# EAGLE board proto4-1pp (EAGLE 6.6.0)
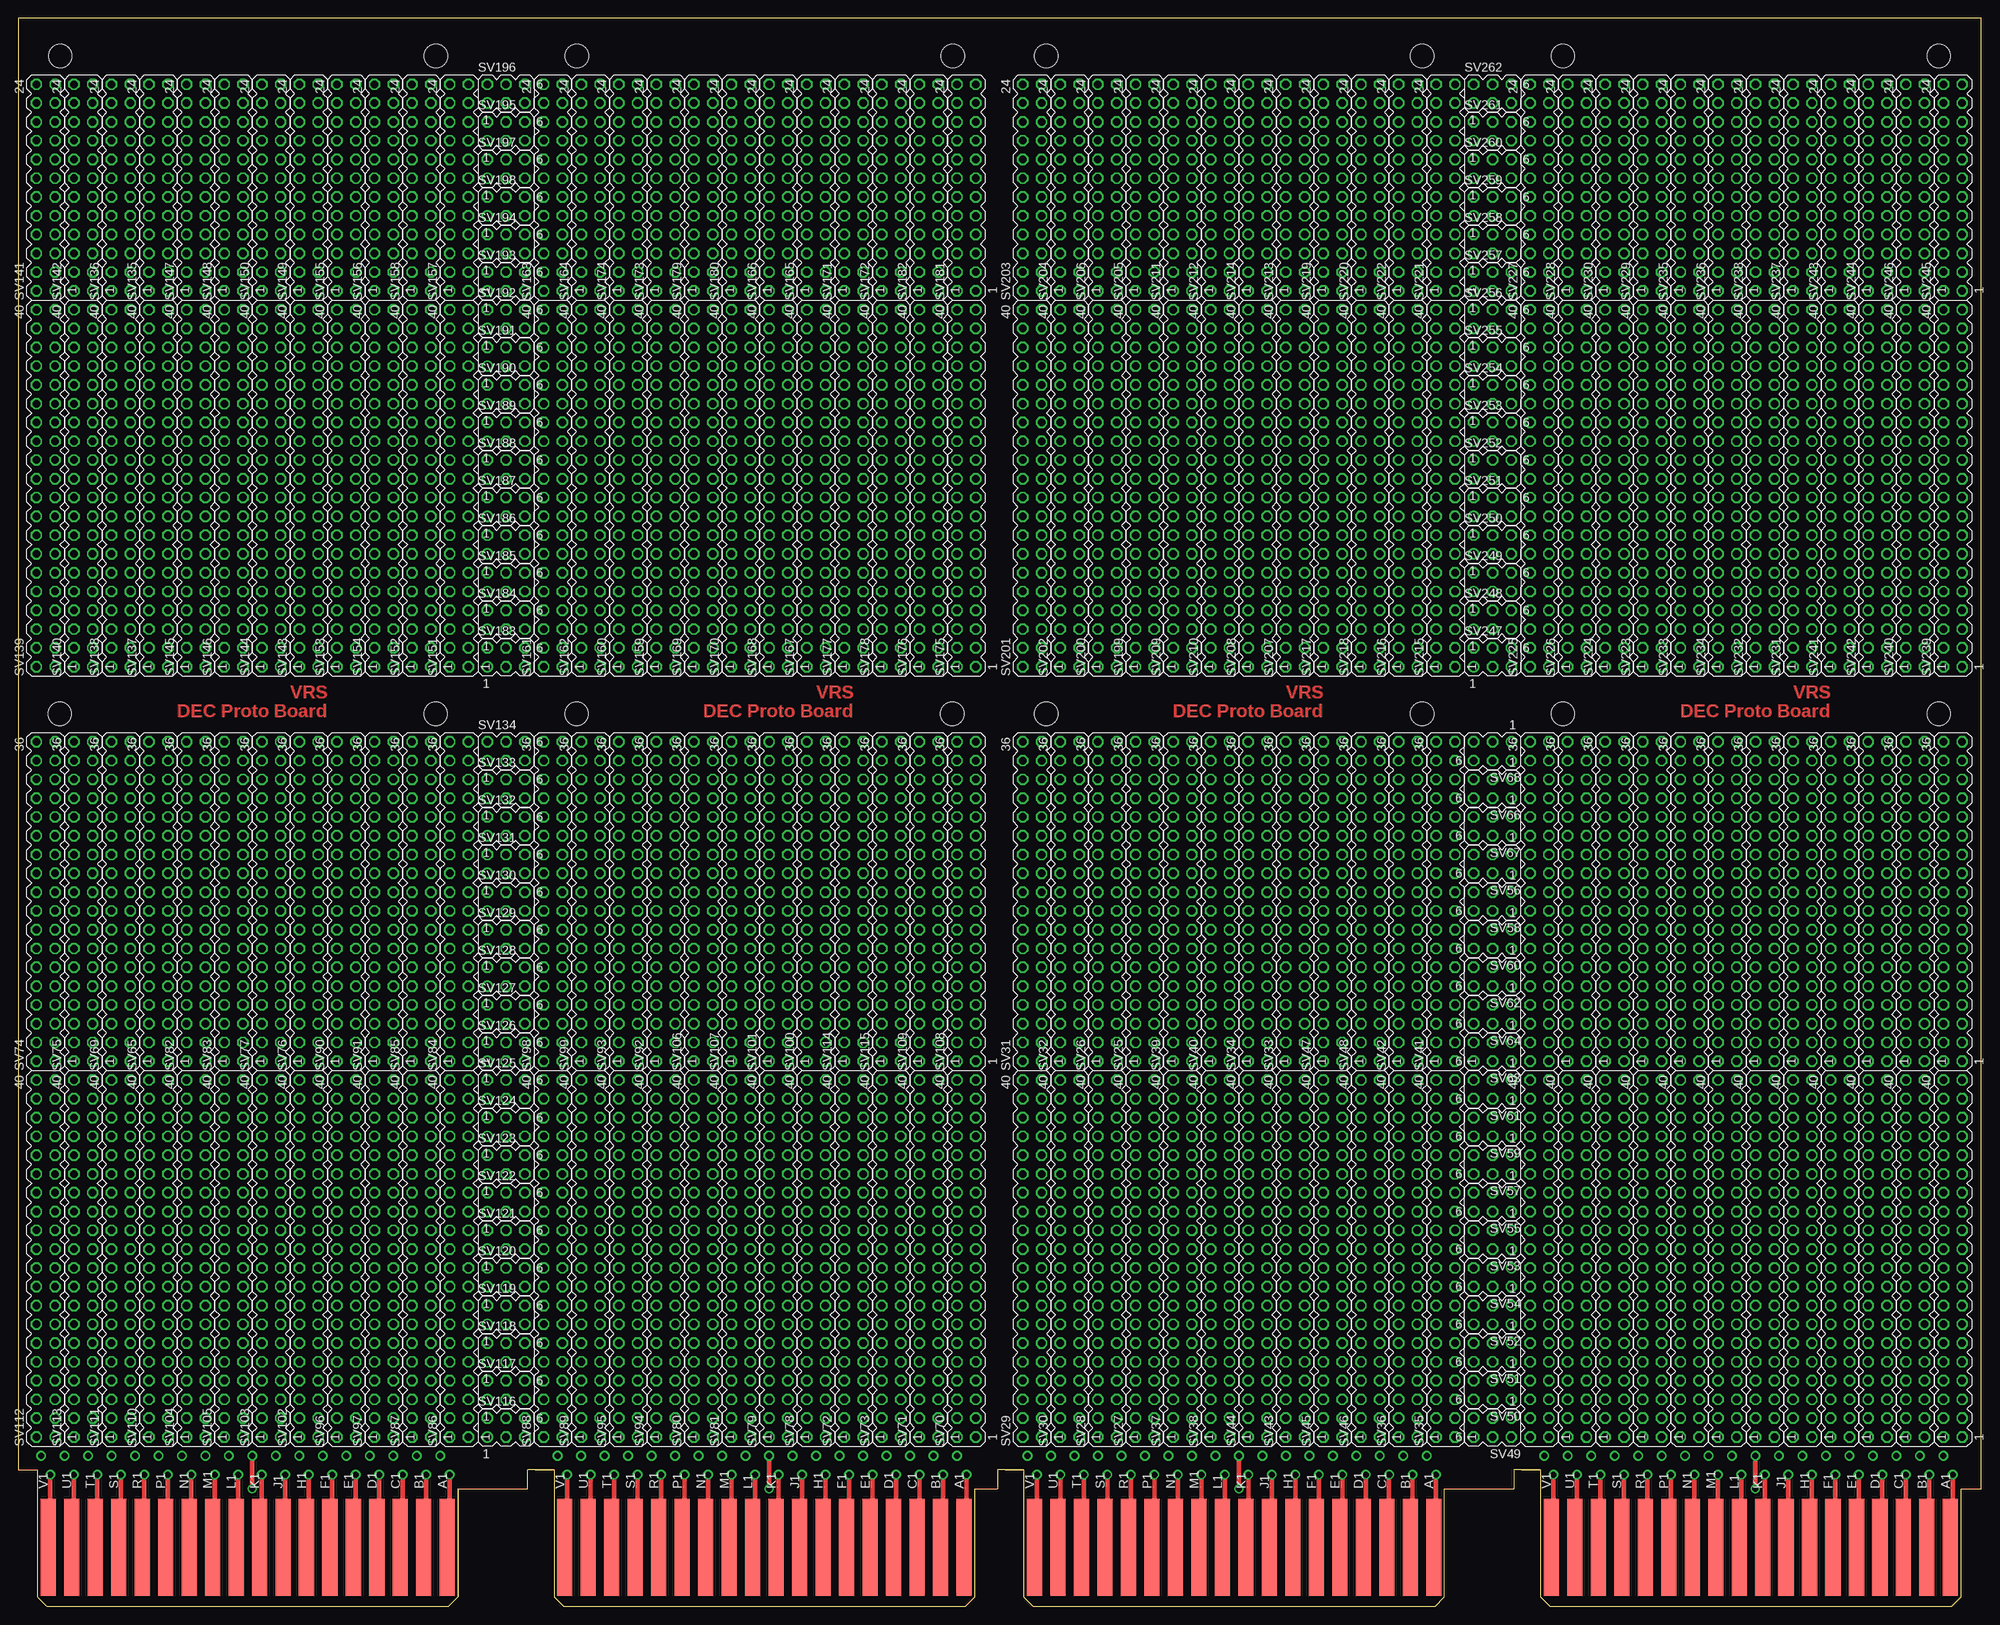
[diagram p5: board, top side]
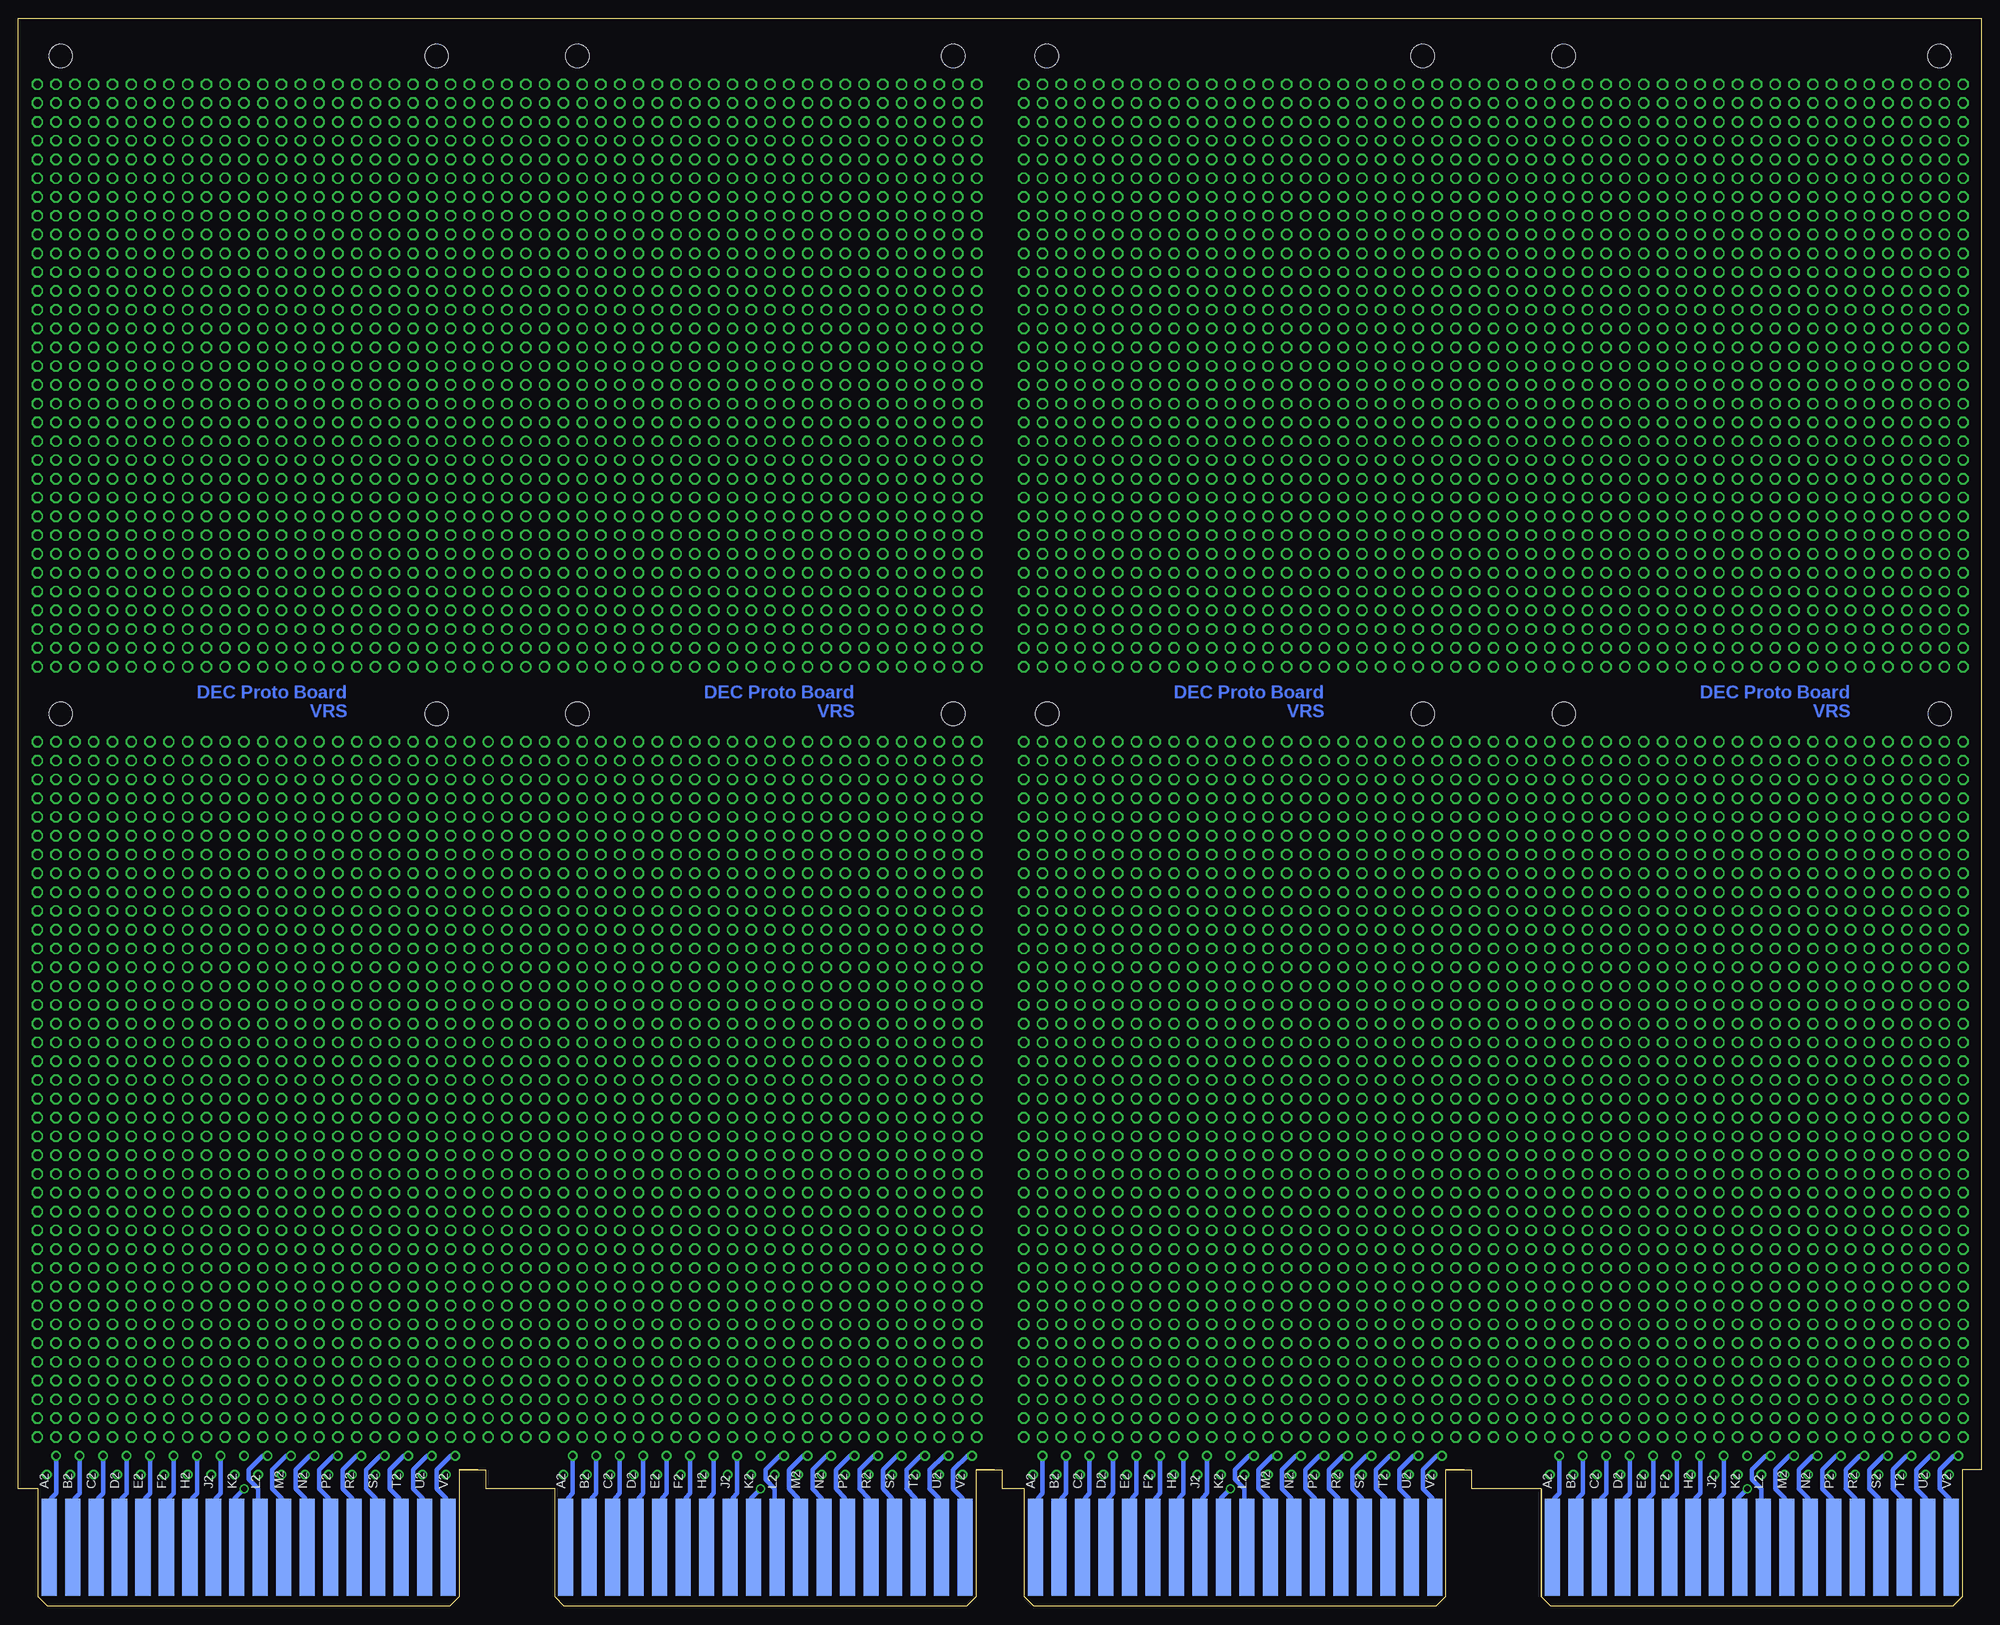
[diagram p6: board, bottom side, seen from below]

Size 265.3 x 214.63 mm. Coordinates in mm from the lower left corner, seen from the top.
Copper layers (1+16): Top 0.035mm / dielectric 1.5mm / Bottom 0.035mm
Design rules "16mils": minimum track width 16mil, minimum drill 32mil, track to track 15mil, track to pad 10mil, pad to pad 10mil, via to via 10mil, smd to smd 10mil, copper to edge 13mil, drill to drill 10mil, minimum pad ring 10mil, minimum via ring 8mil, stop-mask expansion 0mil, vias tented up to drill 0mil, thermal gap 10mil
Net classes: 0 default: width 0.635 mm
Holes 3.17 mm at 5.59,120.65 75.44,120.65 56.39,120.65 126.24,120.65 138.94,120.65 208.79,120.65 189.74,120.65 259.59,120.65

## Footprints (pad centres in the part's own frame; a part is rotated, then mirrored left to right if it is on the bottom)
EDGE-CON2 = smd 13.106 x 2.032: A1 7.938,4.128; B1 7.938,7.303; C1 7.938,10.477; D1 7.938,13.652; E1 7.938,16.828; F1 7.938,20.003; H1 7.938,23.177; J1 7.938,26.352; K1 7.938,29.527; L1 7.938,32.703; M1 7.938,35.877; N1 7.938,39.053; P1 7.938,42.227; R1 7.938,45.403; S1 7.938,48.578; T1 7.938,51.752; U1 7.938,54.928; V1 7.938,58.102 | smd 13.106 x 2.032 bottom: A2 7.938,4.128; B2 7.938,7.303; C2 7.938,10.477; D2 7.938,13.652; E2 7.938,16.828; F2 7.938,20.003; H2 7.938,23.177; J2 7.938,26.352; K2 7.938,29.527; L2 7.938,32.703; M2 7.938,35.877; N2 7.938,39.053; P2 7.938,42.227; R2 7.938,45.403; S2 7.938,48.578; T2 7.938,51.752; U2 7.938,54.928; V2 7.938,58.102
MA20-2 = drill 1.016 octagon: 1 -24.13,-1.27; 2 -24.13,1.27; 3 -21.59,-1.27; 4 -21.59,1.27; 5 -19.05,-1.27; 6 -19.05,1.27; 7 -16.51,-1.27; 8 -16.51,1.27; 9 -13.97,-1.27; 10 -13.97,1.27; 11 -11.43,-1.27; 12 -11.43,1.27; 13 -8.89,-1.27; 14 -8.89,1.27; 15 -6.35,-1.27; 16 -6.35,1.27; 17 -3.81,-1.27; 18 -3.81,1.27; 19 -1.27,-1.27; 20 -1.27,1.27; 21 1.27,-1.27; 22 1.27,1.27; 23 3.81,-1.27; 24 3.81,1.27; 25 6.35,-1.27; 26 6.35,1.27; 27 8.89,-1.27; 28 8.89,1.27; 29 11.43,-1.27; 30 11.43,1.27; 31 13.97,-1.27; 32 13.97,1.27; 33 16.51,-1.27; 34 16.51,1.27; 35 19.05,-1.27; 36 19.05,1.27; 37 21.59,-1.27; 38 21.59,1.27; 39 24.13,-1.27; 40 24.13,1.27
MA18-2 = drill 1.016 octagon: 1 -21.59,-1.27; 2 -21.59,1.27; 3 -19.05,-1.27; 4 -19.05,1.27; 5 -16.51,-1.27; 6 -16.51,1.27; 7 -13.97,-1.27; 8 -13.97,1.27; 9 -11.43,-1.27; 10 -11.43,1.27; 11 -8.89,-1.27; 12 -8.89,1.27; 13 -6.35,-1.27; 14 -6.35,1.27; 15 -3.81,-1.27; 16 -3.81,1.27; 17 -1.27,-1.27; 18 -1.27,1.27; 19 1.27,-1.27; 20 1.27,1.27; 21 3.81,-1.27; 22 3.81,1.27; 23 6.35,-1.27; 24 6.35,1.27; 25 8.89,-1.27; 26 8.89,1.27; 27 11.43,-1.27; 28 11.43,1.27; 29 13.97,-1.27; 30 13.97,1.27; 31 16.51,-1.27; 32 16.51,1.27; 33 19.05,-1.27; 34 19.05,1.27; 35 21.59,-1.27; 36 21.59,1.27
MA03-2 = drill 1.016: 1 -2.54,-1.27 | drill 1.016 octagon: 2 -2.54,1.27; 3 0,-1.27; 4 0,1.27; 5 2.54,-1.27; 6 2.54,1.27
MA12-2 = drill 1.016 octagon: 1 -13.97,-1.27; 2 -13.97,1.27; 3 -11.43,-1.27; 4 -11.43,1.27; 5 -8.89,-1.27; 6 -8.89,1.27; 7 -6.35,-1.27; 8 -6.35,1.27; 9 -3.81,-1.27; 10 -3.81,1.27; 11 -1.27,-1.27; 12 -1.27,1.27; 13 1.27,-1.27; 14 1.27,1.27; 15 3.81,-1.27; 16 3.81,1.27; 17 6.35,-1.27; 18 6.35,1.27; 19 8.89,-1.27; 20 8.89,1.27; 21 11.43,-1.27; 22 11.43,1.27; 23 13.97,-1.27; 24 13.97,1.27
THRU-HOLEA = drill 0.813 pad 1.27: A1 17.78,3.81; A2 20.32,5.08; B1 17.78,6.985; B2 20.32,8.255; C1 17.78,10.16; C2 20.32,11.43; D1 17.78,13.335; D2 20.32,14.605; E1 17.78,16.51; E2 20.32,17.78; F1 17.78,19.685; F2 20.32,20.955; H1 17.78,22.86; H2 20.32,24.13; J1 17.78,26.035; J2 20.32,27.305; K1 17.78,29.21; K2 20.32,30.48; L1 17.78,32.385; L2 20.32,33.655; M1 17.78,35.56; M2 20.32,36.83; N1 17.78,38.735; N2 20.32,40.005; P1 17.78,41.91; P2 20.32,43.18; R1 17.78,45.085; R2 20.32,46.355; S1 17.78,48.26; S2 20.32,49.53; T1 17.78,51.435; T2 20.32,52.705; U1 17.78,54.61; U2 20.32,55.88; V1 17.78,57.785; V2 20.32,59.055
OMNIBUS = hole 3.175: 208.915,209.55; 259.715,209.55; 189.865,209.55; 139.065,209.55; 75.616,209.55; 126.416,209.55; 56.566,209.55; 5.766,209.55

## Placement (x,y rotation side)
A  [EDGE-CON2]  265.3,0 90 top
A1  [EDGE-CON2]  131.95,0 90 top
B  [EDGE-CON2]  195.45,0 90 top
B1  [EDGE-CON2]  62.1,0 90 top
SV1  [MA20-2]  261.49,46.99 90 top
SV2  [MA20-2]  256.41,46.99 90 top
SV3  [MA20-2]  246.25,46.99 90 top
SV4  [MA20-2]  251.33,46.99 90 top
SV5  [MA18-2]  246.25,95.25 90 top
SV6  [MA18-2]  251.33,95.25 90 top
SV7  [MA18-2]  261.49,95.25 90 top
SV8  [MA18-2]  256.41,95.25 90 top
SV9  [MA18-2]  241.17,95.25 90 top
SV10  [MA18-2]  236.09,95.25 90 top
SV11  [MA20-2]  241.17,46.99 90 top
SV12  [MA20-2]  236.09,46.99 90 top
SV13  [MA20-2]  225.93,46.99 90 top
SV14  [MA20-2]  231.01,46.99 90 top
SV15  [MA18-2]  225.93,95.25 90 top
SV16  [MA18-2]  231.01,95.25 90 top
SV17  [MA18-2]  220.85,95.25 90 top
SV18  [MA18-2]  215.77,95.25 90 top
SV19  [MA20-2]  220.85,46.99 90 top
SV20  [MA20-2]  215.77,46.99 90 top
SV21  [MA20-2]  205.61,46.99 90 top
SV22  [MA20-2]  210.69,46.99 90 top
SV23  [MA18-2]  205.61,95.25 90 top
SV24  [MA18-2]  210.69,95.25 90 top
SV25  [MA18-2]  152.27,95.25 90 top
SV26  [MA18-2]  147.19,95.25 90 top
SV27  [MA20-2]  152.27,46.99 90 top
SV28  [MA20-2]  147.19,46.99 90 top
SV29  [MA20-2]  137.03,46.99 90 top
SV30  [MA20-2]  142.11,46.99 90 top
SV31  [MA18-2]  137.03,95.25 90 top
SV32  [MA18-2]  142.11,95.25 90 top
SV33  [MA18-2]  172.59,95.25 90 top
SV34  [MA18-2]  167.51,95.25 90 top
SV35  [MA20-2]  192.91,46.99 90 top
SV36  [MA20-2]  187.83,46.99 90 top
SV37  [MA20-2]  157.35,46.99 90 top
SV38  [MA20-2]  162.43,46.99 90 top
SV39  [MA18-2]  157.35,95.25 90 top
SV40  [MA18-2]  162.43,95.25 90 top
SV41  [MA18-2]  192.91,95.25 90 top
SV42  [MA18-2]  187.83,95.25 90 top
SV43  [MA20-2]  172.59,46.99 90 top
SV44  [MA20-2]  167.51,46.99 90 top
SV45  [MA20-2]  177.67,46.99 90 top
SV46  [MA20-2]  182.75,46.99 90 top
SV47  [MA18-2]  177.67,95.25 90 top
SV48  [MA18-2]  182.75,95.25 90 top
SV49  [MA03-2]  199.26,24.13 180 top
SV50  [MA03-2]  199.26,29.21 180 top
SV51  [MA03-2]  199.26,34.29 180 top
SV52  [MA03-2]  199.26,39.37 180 top
SV53  [MA03-2]  199.26,49.53 180 top
SV54  [MA03-2]  199.26,44.45 180 top
SV55  [MA03-2]  199.26,54.61 180 top
SV56  [MA03-2]  199.26,100.33 180 top
SV57  [MA03-2]  199.26,59.69 180 top
SV58  [MA03-2]  199.26,95.25 180 top
SV59  [MA03-2]  199.26,64.77 180 top
SV60  [MA03-2]  199.26,90.17 180 top
SV61  [MA03-2]  199.26,69.85 180 top
SV62  [MA03-2]  199.26,85.09 180 top
SV63  [MA03-2]  199.26,74.93 180 top
SV64  [MA03-2]  199.26,80.01 180 top
SV65  [MA18-2]  18.92,95.25 90 top
SV66  [MA03-2]  199.26,110.49 180 top
SV67  [MA03-2]  199.26,105.41 180 top
SV68  [MA03-2]  199.26,115.57 180 top
SV69  [MA18-2]  13.84,95.25 90 top
SV70  [MA20-2]  128.14,46.99 90 top
SV71  [MA20-2]  123.06,46.99 90 top
SV72  [MA20-2]  112.9,46.99 90 top
SV73  [MA20-2]  117.98,46.99 90 top
SV74  [MA18-2]  3.68,95.25 90 top
SV75  [MA18-2]  8.76,95.25 90 top
SV76  [MA18-2]  39.24,95.25 90 top
SV77  [MA18-2]  34.16,95.25 90 top
SV78  [MA20-2]  107.82,46.99 90 top
SV79  [MA20-2]  102.74,46.99 90 top
SV80  [MA20-2]  92.58,46.99 90 top
SV81  [MA20-2]  97.66,46.99 90 top
SV82  [MA18-2]  24,95.25 90 top
SV83  [MA18-2]  29.08,95.25 90 top
SV84  [MA18-2]  59.56,95.25 90 top
SV85  [MA18-2]  54.48,95.25 90 top
SV86  [MA20-2]  59.56,46.99 90 top
SV87  [MA20-2]  54.48,46.99 90 top
SV88  [MA20-2]  72.26,46.99 90 top
SV89  [MA20-2]  77.34,46.99 90 top
SV90  [MA18-2]  44.32,95.25 90 top
SV91  [MA18-2]  49.4,95.25 90 top
SV92  [MA18-2]  87.5,95.25 90 top
SV93  [MA18-2]  82.42,95.25 90 top
SV94  [MA20-2]  87.5,46.99 90 top
SV95  [MA20-2]  82.42,46.99 90 top
SV96  [MA20-2]  44.32,46.99 90 top
SV97  [MA20-2]  49.4,46.99 90 top
SV98  [MA18-2]  72.26,95.25 90 top
SV99  [MA18-2]  77.34,95.25 90 top
SV100  [MA18-2]  107.82,95.25 90 top
SV101  [MA18-2]  102.74,95.25 90 top
SV102  [MA20-2]  39.24,46.99 90 top
SV103  [MA20-2]  34.16,46.99 90 top
SV104  [MA20-2]  24,46.99 90 top
SV105  [MA20-2]  29.08,46.99 90 top
SV106  [MA18-2]  92.58,95.25 90 top
SV107  [MA18-2]  97.66,95.25 90 top
SV108  [MA18-2]  128.14,95.25 90 top
SV109  [MA18-2]  123.06,95.25 90 top
SV110  [MA20-2]  18.92,46.99 90 top
SV111  [MA20-2]  13.84,46.99 90 top
SV112  [MA20-2]  3.68,46.99 90 top
SV113  [MA20-2]  8.76,46.99 90 top
SV114  [MA18-2]  112.9,95.25 90 top
SV115  [MA18-2]  117.98,95.25 90 top
SV116  [MA03-2]  65.91,24.13 0 top
SV117  [MA03-2]  65.91,29.21 0 top
SV118  [MA03-2]  65.91,34.29 0 top
SV119  [MA03-2]  65.91,39.37 0 top
SV120  [MA03-2]  65.91,44.45 0 top
SV121  [MA03-2]  65.91,49.53 0 top
SV122  [MA03-2]  65.91,54.61 0 top
SV123  [MA03-2]  65.91,59.69 0 top
SV124  [MA03-2]  65.91,64.77 0 top
SV125  [MA03-2]  65.91,69.85 0 top
SV126  [MA03-2]  65.91,74.93 0 top
SV127  [MA03-2]  65.91,80.01 0 top
SV128  [MA03-2]  65.91,85.09 0 top
SV129  [MA03-2]  65.91,90.17 0 top
SV130  [MA03-2]  65.91,95.25 0 top
SV131  [MA03-2]  65.91,100.33 0 top
SV132  [MA03-2]  65.91,105.41 0 top
SV133  [MA03-2]  65.91,110.49 0 top
SV134  [MA03-2]  65.91,115.57 0 top
SV135  [MA12-2]  18.92,191.77 90 top
SV136  [MA12-2]  13.84,191.77 90 top
SV137  [MA20-2]  18.92,151.13 90 top
SV138  [MA20-2]  13.84,151.13 90 top
SV139  [MA20-2]  3.68,151.13 90 top
SV140  [MA20-2]  8.76,151.13 90 top
SV141  [MA12-2]  3.68,191.77 90 top
SV142  [MA12-2]  8.76,191.77 90 top
SV143  [MA20-2]  39.24,151.13 90 top
SV144  [MA20-2]  34.16,151.13 90 top
SV145  [MA20-2]  24,151.13 90 top
SV146  [MA20-2]  29.08,151.13 90 top
SV147  [MA12-2]  24,191.77 90 top
SV148  [MA12-2]  29.08,191.77 90 top
SV149  [MA12-2]  39.24,191.77 90 top
SV150  [MA12-2]  34.16,191.77 90 top
SV151  [MA20-2]  59.56,151.13 90 top
SV152  [MA20-2]  54.48,151.13 90 top
SV153  [MA20-2]  44.32,151.13 90 top
SV154  [MA20-2]  49.4,151.13 90 top
SV155  [MA12-2]  44.32,191.77 90 top
SV156  [MA12-2]  49.4,191.77 90 top
SV157  [MA12-2]  59.56,191.77 90 top
SV158  [MA12-2]  54.48,191.77 90 top
SV159  [MA20-2]  87.5,151.13 90 top
SV160  [MA20-2]  82.42,151.13 90 top
SV161  [MA20-2]  72.26,151.13 90 top
SV162  [MA20-2]  77.34,151.13 90 top
SV163  [MA12-2]  72.26,191.77 90 top
SV164  [MA12-2]  77.34,191.77 90 top
SV165  [MA12-2]  107.82,191.77 90 top
SV166  [MA12-2]  102.74,191.77 90 top
SV167  [MA20-2]  107.82,151.13 90 top
SV168  [MA20-2]  102.74,151.13 90 top
SV169  [MA20-2]  92.58,151.13 90 top
SV170  [MA20-2]  97.66,151.13 90 top
SV171  [MA12-2]  112.9,191.77 90 top
SV172  [MA12-2]  117.98,191.77 90 top
SV173  [MA12-2]  87.5,191.77 90 top
SV174  [MA12-2]  82.42,191.77 90 top
SV175  [MA20-2]  128.14,151.13 90 top
SV176  [MA20-2]  123.06,151.13 90 top
SV177  [MA20-2]  112.9,151.13 90 top
SV178  [MA20-2]  117.98,151.13 90 top
SV179  [MA12-2]  92.58,191.77 90 top
SV180  [MA12-2]  97.66,191.77 90 top
SV181  [MA12-2]  128.14,191.77 90 top
SV182  [MA12-2]  123.06,191.77 90 top
SV183  [MA03-2]  65.91,128.27 0 top
SV184  [MA03-2]  65.91,133.35 0 top
SV185  [MA03-2]  65.91,138.43 0 top
SV186  [MA03-2]  65.91,143.51 0 top
SV187  [MA03-2]  65.91,148.59 0 top
SV188  [MA03-2]  65.91,153.67 0 top
SV189  [MA03-2]  65.91,158.75 0 top
SV190  [MA03-2]  65.91,163.83 0 top
SV191  [MA03-2]  65.91,168.91 0 top
SV192  [MA03-2]  65.91,173.99 0 top
SV193  [MA03-2]  65.91,179.07 0 top
SV194  [MA03-2]  65.91,184.15 0 top
SV195  [MA03-2]  65.91,199.39 0 top
SV196  [MA03-2]  65.91,204.47 0 top
SV197  [MA03-2]  65.91,194.31 0 top
SV198  [MA03-2]  65.91,189.23 0 top
SV199  [MA20-2]  152.27,151.13 90 top
SV200  [MA20-2]  147.19,151.13 90 top
SV201  [MA20-2]  137.03,151.13 90 top
SV202  [MA20-2]  142.11,151.13 90 top
SV203  [MA12-2]  137.03,191.77 90 top
SV204  [MA12-2]  142.11,191.77 90 top
SV205  [MA12-2]  152.27,191.77 90 top
SV206  [MA12-2]  147.19,191.77 90 top
SV207  [MA20-2]  172.59,151.13 90 top
SV208  [MA20-2]  167.51,151.13 90 top
SV209  [MA20-2]  157.35,151.13 90 top
SV210  [MA20-2]  162.43,151.13 90 top
SV211  [MA12-2]  157.35,191.77 90 top
SV212  [MA12-2]  162.43,191.77 90 top
SV213  [MA12-2]  172.59,191.77 90 top
SV214  [MA12-2]  167.51,191.77 90 top
SV215  [MA20-2]  192.91,151.13 90 top
SV216  [MA20-2]  187.83,151.13 90 top
SV217  [MA20-2]  177.67,151.13 90 top
SV218  [MA20-2]  182.75,151.13 90 top
SV219  [MA12-2]  177.67,191.77 90 top
SV220  [MA12-2]  182.75,191.77 90 top
SV221  [MA12-2]  192.91,191.77 90 top
SV222  [MA12-2]  187.83,191.77 90 top
SV223  [MA20-2]  220.85,151.13 90 top
SV224  [MA20-2]  215.77,151.13 90 top
SV225  [MA20-2]  205.61,151.13 90 top
SV226  [MA20-2]  210.69,151.13 90 top
SV227  [MA12-2]  205.61,191.77 90 top
SV228  [MA12-2]  210.69,191.77 90 top
SV229  [MA12-2]  220.85,191.77 90 top
SV230  [MA12-2]  215.77,191.77 90 top
SV231  [MA20-2]  241.17,151.13 90 top
SV232  [MA20-2]  236.09,151.13 90 top
SV233  [MA20-2]  225.93,151.13 90 top
SV234  [MA20-2]  231.01,151.13 90 top
SV235  [MA12-2]  225.93,191.77 90 top
SV236  [MA12-2]  231.01,191.77 90 top
SV237  [MA12-2]  241.17,191.77 90 top
SV238  [MA12-2]  236.09,191.77 90 top
SV239  [MA20-2]  261.49,151.13 90 top
SV240  [MA20-2]  256.41,151.13 90 top
SV241  [MA20-2]  246.25,151.13 90 top
SV242  [MA20-2]  251.33,151.13 90 top
SV243  [MA12-2]  246.25,191.77 90 top
SV244  [MA12-2]  251.33,191.77 90 top
SV245  [MA12-2]  261.49,191.77 90 top
SV246  [MA12-2]  256.41,191.77 90 top
SV247  [MA03-2]  199.26,128.27 0 top
SV248  [MA03-2]  199.26,133.35 0 top
SV249  [MA03-2]  199.26,138.43 0 top
SV250  [MA03-2]  199.26,143.51 0 top
SV251  [MA03-2]  199.26,148.59 0 top
SV252  [MA03-2]  199.26,153.67 0 top
SV253  [MA03-2]  199.26,158.75 0 top
SV254  [MA03-2]  199.26,163.83 0 top
SV255  [MA03-2]  199.26,168.91 0 top
SV256  [MA03-2]  199.26,173.99 0 top
SV257  [MA03-2]  199.26,179.07 0 top
SV258  [MA03-2]  199.26,184.15 0 top
SV259  [MA03-2]  199.26,189.23 0 top
SV260  [MA03-2]  199.26,194.31 0 top
SV261  [MA03-2]  199.26,199.39 0 top
SV262  [MA03-2]  199.26,204.47 0 top
U$1  THRU-HOLE2A  [THRU-HOLEA]  131.95,0 90 top
U$3  THRU-HOLE2A  [THRU-HOLEA]  265.3,0 90 top
U$5  THRU-HOLE2A  [THRU-HOLEA]  195.45,0 90 top
U$6  THRU-HOLE2A  [THRU-HOLEA]  62.1,0 90 top
U$7  OUTLINE-OMNIBUS  [OMNIBUS]  -0.13,0 0 top

## Tracks (layer width: path | path; a pad name or v marks a point on that pad's centre or on a via)
N$1  (via drill 0.81)
  Top 0.635: U$3.K2 v234.82,15.88
  Bottom 0.635: v234.82,15.88 236.09,14.61 A.K2
N$2
  Bottom 0.635: U$3.J2 238,15.24 238.63,14.61 A.J2
N$3
  Bottom 0.635: U$3.H2 241.17,15.24 241.81,14.61 A.H2
N$4
  Bottom 0.635: U$3.L2 232.28,20.32 234.19,18.41 234.19,17.14 232.92,15.88 232.92,13.34 A.L2
N$5
  Bottom 0.635: U$3.M2 229.11,20.32 231.01,18.41 231.01,15.88 229.74,14.61 A.M2
N$6
  Bottom 0.635: U$3.N2 225.93,20.32 227.84,18.41 227.84,15.88 226.57,14.61 A.N2
N$7
  Bottom 0.635: U$3.P2 222.76,20.32 224.66,18.41 224.66,15.88 223.39,14.61 A.P2
N$8
  Bottom 0.635: U$3.F2 244.35,15.24 244.98,14.61 A.F2
N$9
  Bottom 0.635: U$3.E2 247.52,15.24 248.16,14.61 A.E2
N$10
  Bottom 0.635: U$3.D2 250.7,15.24 251.33,14.61 A.D2
N$11
  Bottom 0.635: U$3.A2 260.22,15.24 260.86,14.61 A.A2
N$12
  Bottom 0.635: U$3.R2 219.58,20.32 221.49,18.41 221.49,15.88 220.22,14.61 A.R2
N$13
  Bottom 0.635: U$3.S2 216.41,20.32 218.31,18.41 218.31,15.88 217.04,14.61 A.S2
N$14
  Bottom 0.635: U$3.B2 257.05,15.24 257.68,14.61 A.B2
N$15
  Bottom 0.635: U$3.C2 253.87,15.24 254.51,14.61 A.C2
N$16
  Bottom 0.635: U$3.T2 213.23,20.32 215.14,18.41 215.14,15.88 213.87,14.61 A.T2
N$17
  Bottom 0.635: U$3.U2 210.06,20.32 211.96,18.41 211.96,15.88 210.69,14.61 A.U2
N$18
  Bottom 0.635: U$3.V2 206.88,20.32 208.79,18.41 208.79,15.88 207.52,14.61 A.V2
N$19
  Top 0.635: U$3.A1 261.49,17.14 261.49,13.97 A.A1
N$20
  Top 0.635: U$3.V1 207.52,17.14 207.52,13.97 A.V1
N$21
  Top 0.635: U$3.U1 210.69,17.14 210.69,13.97 A.U1
N$22
  Top 0.635: U$3.T1 213.87,17.14 213.87,13.97 A.T1
N$23
  Top 0.635: U$3.S1 217.04,17.14 217.04,13.97 A.S1
N$24
  Top 0.635: U$3.R1 220.22,17.14 220.22,13.97 A.R1
N$25
  Top 0.635: U$3.P1 223.39,17.14 223.39,13.97 A.P1
N$26
  Top 0.635: U$3.N1 226.57,17.14 226.57,13.97 A.N1
N$27
  Top 0.635: U$3.M1 229.74,17.14 229.74,13.97 A.M1
N$28
  Top 0.635: U$3.L1 232.92,17.14 232.92,13.97 A.L1
N$29
  Top 0.635: U$3.K1 236.09,17.14 236.09,13.97 A.K1
N$30
  Top 0.635: U$3.J1 239.27,17.14 239.27,13.97 A.J1
N$31
  Top 0.635: U$3.H1 242.44,17.14 242.44,13.97 A.H1
N$32
  Top 0.635: U$3.F1 245.62,17.14 245.62,13.97 A.F1
N$33
  Top 0.635: U$3.E1 248.79,17.14 248.79,13.97 A.E1
N$34
  Top 0.635: U$3.D1 251.97,17.14 251.97,13.97 A.D1
N$35
  Top 0.635: U$3.C1 255.14,17.14 255.14,13.97 A.C1
N$36
  Top 0.635: U$3.B1 258.32,17.14 258.32,13.97 A.B1
N$37
  Bottom 0.635: U$5.C2 184.02,15.24 184.66,14.61 B.C2
N$38
  Bottom 0.635: U$5.A2 190.37,15.24 191.01,14.61 B.A2
N$39
  Bottom 0.635: U$1.A2 126.87,15.24 127.51,14.61 A1.A2
N$40
  Bottom 0.635: U$1.C2 120.52,15.24 121.16,14.61 A1.C2
N$41
  Bottom 0.635: U$6.C2 50.67,15.24 51.31,14.61 B1.C2
N$42
  Bottom 0.635: U$6.A2 57.02,15.24 57.66,14.61 B1.A2
N$263  (via drill 0.81)
  Top 0.635: v164.97,15.88 U$5.K2
  Bottom 0.635: v164.97,15.88 166.24,14.61 B.K2
N$264
  Bottom 0.635: U$5.J2 168.15,15.24 168.78,14.61 B.J2
N$265
  Bottom 0.635: U$5.H2 171.32,15.24 171.96,14.61 B.H2
N$266
  Bottom 0.635: U$5.L2 162.43,20.32 164.34,18.41 164.34,17.14 163.07,15.88 163.07,13.97 B.L2
N$267
  Bottom 0.635: U$5.M2 159.26,20.32 161.16,18.41 161.16,15.88 159.89,14.61 B.M2
N$268
  Bottom 0.635: U$5.N2 156.08,20.32 157.99,18.41 157.99,15.88 156.72,14.61 B.N2
N$269
  Bottom 0.635: U$5.P2 152.91,20.32 154.81,18.41 154.81,15.88 153.54,14.61 B.P2
N$270
  Bottom 0.635: U$5.F2 174.5,15.24 175.13,14.61 B.F2
N$271
  Bottom 0.635: U$5.E2 177.67,15.24 178.31,14.61 B.E2
N$272
  Bottom 0.635: U$5.D2 180.85,15.24 181.48,14.61 B.D2
N$273
  Bottom 0.635: U$5.R2 149.73,20.32 151.64,18.41 151.64,15.88 150.37,14.61 B.R2
N$274
  Bottom 0.635: U$5.S2 146.56,20.32 148.46,18.41 148.46,15.88 147.19,14.61 B.S2
N$275
  Bottom 0.635: U$5.B2 187.2,15.24 187.83,14.61 B.B2
N$276
  Bottom 0.635: U$5.T2 143.38,20.32 145.29,18.41 145.29,15.88 144.02,14.61 B.T2
N$277
  Bottom 0.635: U$5.U2 140.21,20.32 142.11,18.41 142.11,15.88 140.84,14.61 B.U2
N$278
  Bottom 0.635: U$5.V2 137.03,20.32 138.94,18.41 138.94,15.88 137.67,14.61 B.V2
N$279
  Top 0.635: U$5.A1 191.64,17.14 191.64,13.97 B.A1
N$280
  Top 0.635: U$5.V1 137.67,17.14 137.67,13.97 B.V1
N$281
  Top 0.635: U$5.U1 140.84,17.14 140.84,13.97 B.U1
N$282
  Top 0.635: U$5.T1 144.02,17.14 144.02,13.97 B.T1
N$283
  Top 0.635: U$5.S1 147.19,17.14 147.19,13.97 B.S1
N$284
  Top 0.635: U$5.R1 150.37,17.14 150.37,13.97 B.R1
N$285
  Top 0.635: U$5.P1 153.54,17.14 153.54,13.97 B.P1
N$286
  Top 0.635: U$5.N1 156.72,17.14 156.72,13.97 B.N1
N$287
  Top 0.635: U$5.M1 159.89,17.14 159.89,13.97 B.M1
N$288
  Top 0.635: U$5.L1 163.07,17.14 163.07,13.97 B.L1
N$289
  Top 0.635: U$5.K1 166.24,17.14 166.24,13.97 B.K1
N$290
  Top 0.635: U$5.J1 169.42,17.14 169.42,13.97 B.J1
N$291
  Top 0.635: U$5.H1 172.59,17.14 172.59,13.97 B.H1
N$292
  Top 0.635: U$5.F1 175.77,17.14 175.77,13.97 B.F1
N$293
  Top 0.635: U$5.E1 178.94,17.14 178.94,13.97 B.E1
N$294
  Top 0.635: U$5.D1 182.12,17.14 182.12,13.97 B.D1
N$295
  Top 0.635: U$5.C1 185.29,17.14 185.29,13.97 B.C1
N$296
  Top 0.635: U$5.B1 188.47,17.14 188.47,13.97 B.B1
N$563  (via drill 0.81)
  Top 0.635: v101.47,15.88 U$1.K2
  Bottom 0.635: v101.47,15.88 102.74,14.61 A1.K2
N$564
  Bottom 0.635: U$1.J2 104.65,15.24 105.28,14.61 A1.J2
N$565
  Bottom 0.635: U$1.H2 107.82,15.24 108.46,14.61 A1.H2
N$566
  Bottom 0.635: U$1.L2 98.93,20.32 100.84,18.41 100.84,17.14 99.57,15.88 99.57,13.34 A1.L2
N$567
  Bottom 0.635: U$1.M2 95.76,20.32 97.66,18.41 97.66,15.88 96.39,14.61 A1.M2
N$568
  Bottom 0.635: U$1.N2 92.58,20.32 94.49,18.41 94.49,15.88 93.22,14.61 A1.N2
N$569
  Bottom 0.635: U$1.P2 89.41,20.32 91.31,18.41 91.31,15.88 90.04,14.61 A1.P2
N$570
  Bottom 0.635: U$1.F2 111,15.24 111.63,14.61 A1.F2
N$571
  Bottom 0.635: U$1.E2 114.17,15.24 114.81,14.61 A1.E2
N$572
  Bottom 0.635: U$1.D2 117.35,15.24 117.98,14.61 A1.D2
N$573
  Bottom 0.635: U$1.R2 86.23,20.32 88.14,18.41 88.14,15.88 86.87,14.61 A1.R2
N$574
  Bottom 0.635: U$1.S2 83.06,20.32 84.96,18.41 84.96,15.88 83.69,14.61 A1.S2
N$575
  Bottom 0.635: U$1.B2 123.7,15.24 124.33,14.61 A1.B2
N$576
  Bottom 0.635: U$1.T2 79.88,20.32 81.79,18.41 81.79,15.88 80.52,14.61 A1.T2
N$577
  Bottom 0.635: U$1.U2 76.71,20.32 78.61,18.41 78.61,15.88 77.34,14.61 A1.U2
N$578
  Bottom 0.635: U$1.V2 73.53,20.32 75.44,18.41 75.44,15.88 74.17,14.61 A1.V2
N$579
  Top 0.635: U$1.A1 128.14,17.14 128.14,13.97 A1.A1
N$580
  Top 0.635: U$1.V1 74.17,17.14 74.17,13.97 A1.V1
N$581
  Top 0.635: U$1.U1 77.34,17.14 77.34,13.97 A1.U1
N$582
  Top 0.635: U$1.T1 80.52,17.14 80.52,13.97 A1.T1
N$583
  Top 0.635: U$1.S1 83.69,17.14 83.69,13.97 A1.S1
N$584
  Top 0.635: U$1.R1 86.87,17.14 86.87,13.97 A1.R1
N$585
  Top 0.635: U$1.P1 90.04,17.14 90.04,13.97 A1.P1
N$586
  Top 0.635: U$1.N1 93.22,17.14 93.22,13.97 A1.N1
N$587
  Top 0.635: U$1.M1 96.39,17.14 96.39,13.97 A1.M1
N$588
  Top 0.635: U$1.L1 99.57,17.14 99.57,13.97 A1.L1
N$589
  Top 0.635: U$1.K1 102.74,17.14 102.74,13.97 A1.K1
N$590
  Top 0.635: U$1.J1 105.92,17.14 105.92,13.97 A1.J1
N$591
  Top 0.635: U$1.H1 109.09,17.14 109.09,13.97 A1.H1
N$592
  Top 0.635: U$1.F1 112.27,17.14 112.27,13.97 A1.F1
N$593
  Top 0.635: U$1.E1 115.44,17.14 115.44,13.97 A1.E1
N$594
  Top 0.635: U$1.D1 118.62,17.14 118.62,13.97 A1.D1
N$595
  Top 0.635: U$1.C1 121.79,17.14 121.79,13.97 A1.C1
N$596
  Top 0.635: U$1.B1 124.97,17.14 124.97,13.97 A1.B1
N$825  (via drill 0.81)
  Top 0.635: v31.62,15.88 U$6.K2
  Bottom 0.635: v31.62,15.88 32.89,14.61 B1.K2
N$826
  Bottom 0.635: U$6.J2 34.8,15.24 35.43,14.61 B1.J2
N$827
  Bottom 0.635: U$6.H2 37.97,15.24 38.61,14.61 B1.H2
N$828
  Bottom 0.635: U$6.L2 29.08,20.32 30.99,18.41 30.99,17.14 29.72,15.88 29.72,13.34 B1.L2
N$829
  Bottom 0.635: U$6.M2 25.91,20.32 27.81,18.41 27.81,15.88 26.54,14.61 B1.M2
N$830
  Bottom 0.635: U$6.N2 22.73,20.32 24.64,18.41 24.64,15.88 23.37,14.61 B1.N2
N$831
  Bottom 0.635: U$6.P2 19.56,20.32 21.46,18.41 21.46,15.88 20.19,14.61 B1.P2
N$832
  Bottom 0.635: U$6.F2 41.15,15.24 41.78,14.61 B1.F2
N$833
  Bottom 0.635: U$6.E2 44.32,15.24 44.96,14.61 B1.E2
N$834
  Bottom 0.635: U$6.D2 47.5,15.24 48.13,14.61 B1.D2
N$835
  Bottom 0.635: U$6.R2 16.38,20.32 18.29,18.41 18.29,15.88 17.02,14.61 B1.R2
N$836
  Bottom 0.635: U$6.S2 13.21,20.32 15.11,18.41 15.11,15.88 13.84,14.61 B1.S2
N$837
  Bottom 0.635: U$6.B2 53.85,15.24 54.48,14.61 B1.B2
N$838
  Bottom 0.635: U$6.T2 10.03,20.32 11.94,18.41 11.94,15.88 10.67,14.61 B1.T2
N$839
  Bottom 0.635: U$6.U2 6.86,20.32 8.76,18.41 8.76,15.88 7.49,14.61 B1.U2
N$840
  Bottom 0.635: U$6.V2 3.68,20.32 5.59,18.41 5.59,15.88 4.32,14.61 B1.V2
N$841
  Top 0.635: U$6.A1 58.29,17.14 58.29,13.97 B1.A1
N$842
  Top 0.635: U$6.V1 4.32,17.14 4.32,13.97 B1.V1
N$843
  Top 0.635: U$6.U1 7.49,17.14 7.49,13.97 B1.U1
N$844
  Top 0.635: U$6.T1 10.67,17.14 10.67,13.97 B1.T1
N$845
  Top 0.635: U$6.S1 13.84,17.14 13.84,13.97 B1.S1
N$846
  Top 0.635: U$6.R1 17.02,17.14 17.02,13.97 B1.R1
N$847
  Top 0.635: U$6.P1 20.19,17.14 20.19,13.97 B1.P1
N$848
  Top 0.635: U$6.N1 23.37,17.14 23.37,13.97 B1.N1
N$849
  Top 0.635: U$6.M1 26.54,17.14 26.54,13.97 B1.M1
N$850
  Top 0.635: U$6.L1 29.72,17.14 29.72,13.97 B1.L1
N$851
  Top 0.635: U$6.K1 32.89,17.14 32.89,13.97 B1.K1
N$852
  Top 0.635: U$6.J1 36.07,17.14 36.07,13.97 B1.J1
N$853
  Top 0.635: U$6.H1 39.24,17.14 39.24,13.97 B1.H1
N$854
  Top 0.635: U$6.F1 42.42,17.14 42.42,13.97 B1.F1
N$855
  Top 0.635: U$6.E1 45.59,17.14 45.59,13.97 B1.E1
N$856
  Top 0.635: U$6.D1 48.77,17.14 48.77,13.97 B1.D1
N$857
  Top 0.635: U$6.C1 51.94,17.14 51.94,13.97 B1.C1
N$858
  Top 0.635: U$6.B1 55.12,17.14 55.12,13.97 B1.B1

## Text on the board
Top: VRS | VRS | VRS | VRS | DEC Proto Board | DEC Proto Board | DEC Proto Board | DEC Proto Board
Bottom: DEC Proto Board | DEC Proto Board | DEC Proto Board | DEC Proto Board | VRS | VRS | VRS | VRS